# Altium schematic sheet OBwod_sterowania_STM32.SchDoc
size A4
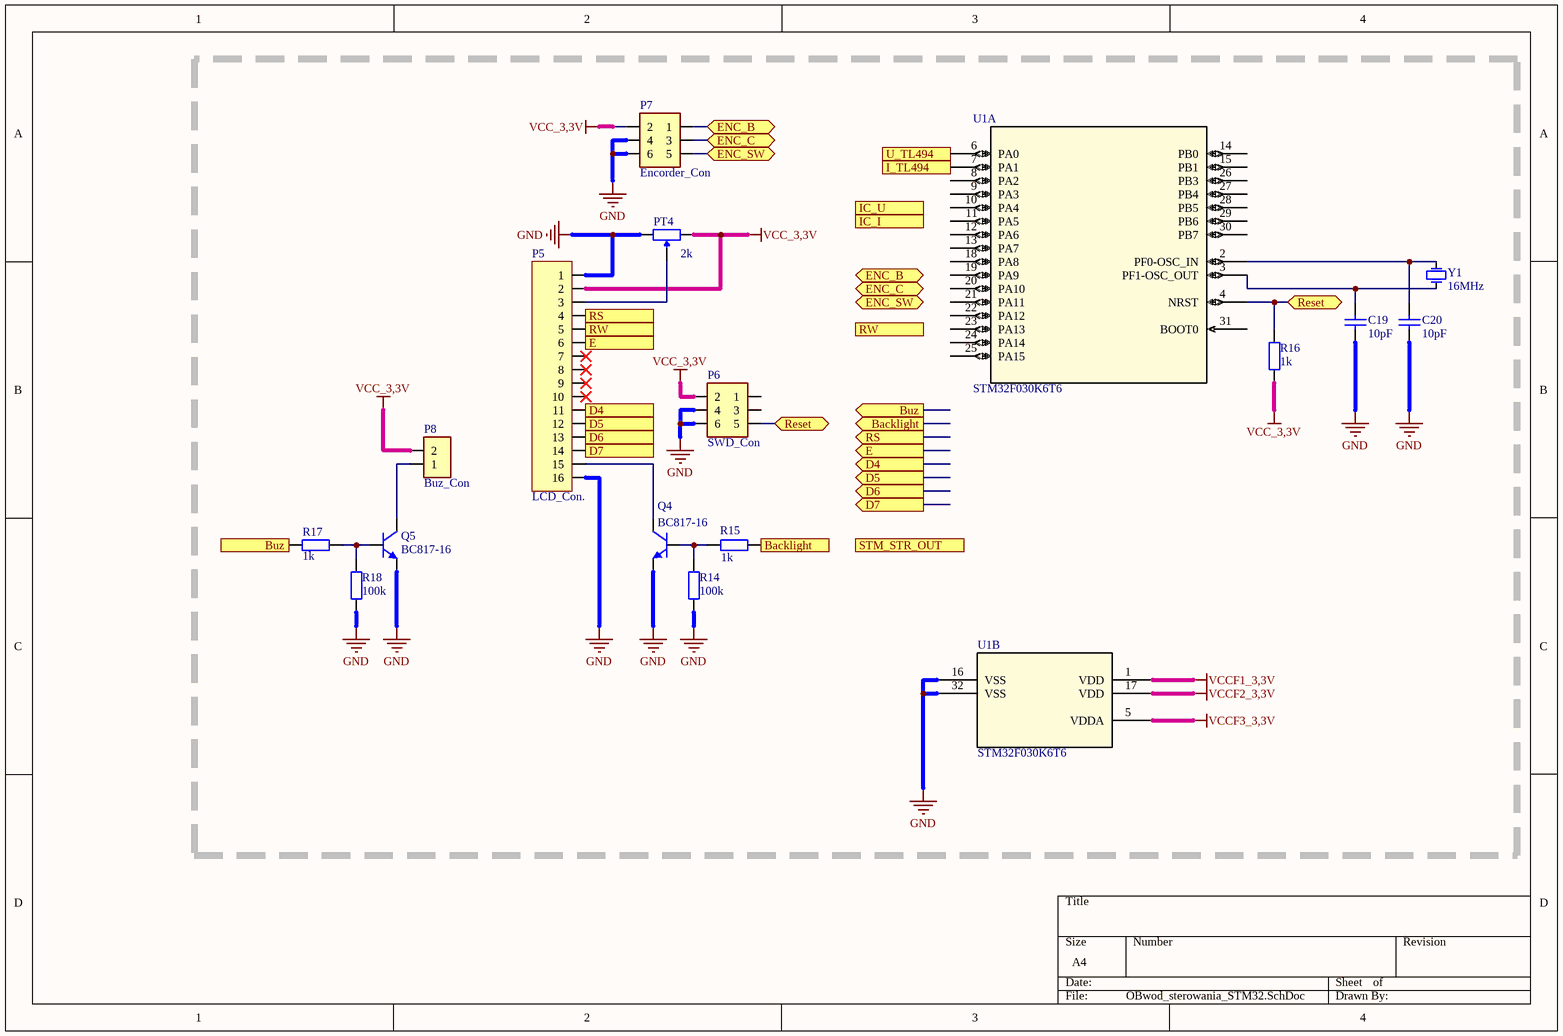
[diagram p0: OBwod_sterowania_STM32.SchDoc]

## Parts
C19  Parametr_1: 10pF  [SMD-1206C]  (hidden comment: Kondesator)
C20  Parametr_1: 10pF  [SMD-1206C]  (hidden comment: Kondesator)
P5  LCD_Con.  [Header_Male 1x16]
P6  SWD_Con  [goldpin SMD 1,27]
P7  Encorder_Con  [Header_Male 2X3]
P8  Buz_Con  [Header_Male 1x2]
PT4  Parametr_1: 2k  [Potecjomert]  (hidden comment: Potentiometer)
Q4  BC817-16  [SOT323]
Q5  BC817-16  [SOT323]
R14  Parametr_1: 100k  [SMD-1206-RES]  (hidden comment: Rezystor)
R15  Parametr_1: 1k  [SMD-1206-RES]  (hidden comment: Rezystor)
R16  Parametr_1: 1k  [SMD-1206-RES]  (hidden comment: Rezystor)
R17  Parametr_1: 1k  [SMD-1206-RES]  (hidden comment: Rezystor)
R18  Parametr_1: 100k  [SMD-1206-RES]  (hidden comment: Rezystor)
U1  STM32F030K6T6  [LQFP-32]  (parts A,B of 2)
Y1  16MHz  [HC49SM]

## Ports
Backlight (in), Backlight (out), Buz (in), Buz (out), D4 (in), D4 (out), D5 (in), D5 (out), D6 (in), D6 (out), D7 (in), D7 (out), E (in), E (out), ENC_B (bidir), ENC_C (bidir), ENC_SW (bidir), I_TL494 (in), IC_I (out), IC_U (out), Reset (bidir), RS (in), RS (out), RW (in), RW (out), STM_STR_OUT (out), U_TL494 (in)

## Nets
GND: C19.2 C20.1 P5.1 P5.16 P6.4 P6.6 P7.4 P7.6 PT4.1(TOP) Q4.2(E) Q5.2(E) R14.2 R18.2 U1.16(VSS) U1.32(VSS)
VCC_3,3V: P5.2 P6.2 P7.2 P8.2 PT4.3(BOT) R16.1
VCCF1_3,3V: U1.1(VDD)
VCCF2_3,3V: U1.17(VDD)
VCCF3_3,3V: U1.5(VDDA)
Backlight: R15.1 ; port Backlight
Buz: R17.1 ; port Buz
D4: P5.11 ; port D4
D5: P5.12 ; port D5
D6: P5.13 ; port D6
D7: P5.14 ; port D7
E: P5.6 ; port E
ENC_B: P7.1 ; port ENC_B
ENC_C: P7.3 ; port ENC_C
ENC_SW: P7.5 ; port ENC_SW
I_TL494: U1.7(PA1) ; port I_TL494
Reset: P6.5 R16.2 U1.4(NRST) ; port Reset
RS: P5.4 ; port RS
RW: P5.5 ; port RW
U_TL494: U1.6(PA0) ; port U_TL494
NetC19_1: C19.1 U1.3(PF1-OSC_OUT) Y1.1(OSC1)
NetC20_2: C20.2 U1.2(PF0-OSC_IN) Y1.2(OSC2)
NetP5_3: P5.3 PT4.2(TAP)
NetP5_15: P5.15 Q4.3(C)
NetP8_1: P8.1 Q5.3(C)
NetQ4_1: Q4.1(B) R14.1 R15.2
NetQ5_1: Q5.1(B) R17.2 R18.1

Not connected (* = marked no-connect by the designer): P5 7* 8* 9* 10*; P6 1 3; U1 8(PA2) 9(PA3) 10(PA4) 11(PA5) 12(PA6) 13(PA7) 14(PB0) 15(PB1) 18(PA8) 19(PA9) 20(PA10) 21(PA11) 22(PA12) 23(PA13) 24(PA14) 25(PA15) 26(PB3) 27(PB4) 28(PB5) 29(PB6) 30(PB7) 31(BOOT0)

## Library data of the parts
C19 C20 = Kondesator: Dostawca: TME; Montaż: SMD; Obudowa: 1206; Parametr_2: Napięcie:; Parametr_3: Tolerancja:; Parametr_4: Temperatura pracy:; Nazwa: Kondesator; Kod TME: 1206B104K500CT
P5 = Header 16: Header, 16-Pin; LatestRevisionDate: 17-Jul-2002; LatestRevisionNote: Re-released for DXP Platform.; Publisher: Altium Limited
P6 P7 = Header 2x3: Nazwa: Header 2x3
P8 = Header 2: LatestRevisionDate: 17-Jul-2002; LatestRevisionNote: Re-released for DXP Platform.; Publisher: Altium Limited
PT4 = Potentiometer: Potentiometer montażowy wielobortowy; Parametr_2: Moc:; Parametr_3: Tolerancja:; Parametr_4: Charakterystyka:; Parametr_5: Temperatura pracy:; Parametr_6: Max nap. pracy:; Nazwa: Potentiometer montażowy wielobortowy
Q4 Q5 = BC817-16: Tranzystor bipolarny PNP; Dostawca: TME; Montaż: SMD; Producent: DIOTEC SEMICONDUCTOR; Parametr_3: Npa. C-E: 45V; Parametr_4: Wzmocnienie: 100-250; Parametr_5: Częstotliwość: 100Mhz; Parametr_2: Prąd kolektora: 0,8A; Nazwa: Tranzystor bipolarny PNP; Obudowa: SOT323; Oznaczenie: BC817-16; Kod TME: BC817-16-DIO
R14-R18 = Rezystor: Dostawca: TME; Montaż: SMD; Obudowa: 1206; Parametr_2: Moc: 0,250W; Parametr_3: Tolerancja: 5%; Parametr_4: Max nap. pracy:; Parametr_5: Max nap impulsowe:; Nazwa: Rezystor; Kod TME: SMD1206-100K
U1 = STM32F030K6T6: No Description Available; Mfr_Name: STMicroelectronics; Copyright: Copyright (C) 2022 Ultra Librarian. All rights reserved.; Manufacturer_Part_Number: STM32F030K6T6; RefDes: RefDes; Type: DEV
Y1 = Oscylator